# Altium schematic sheet RF_Antenna.SchDoc: Antenna & Radio Interface
size A4; Author: SORABH GANDHI; DrawnBy: SORABH GANDHI; Engineer: SORABH GANDHI; Organization: University Of Colorado Boulder; Revision: 1.0; SheetNumber: 5; SheetTotal: 10; ProjectName: Low Power Project
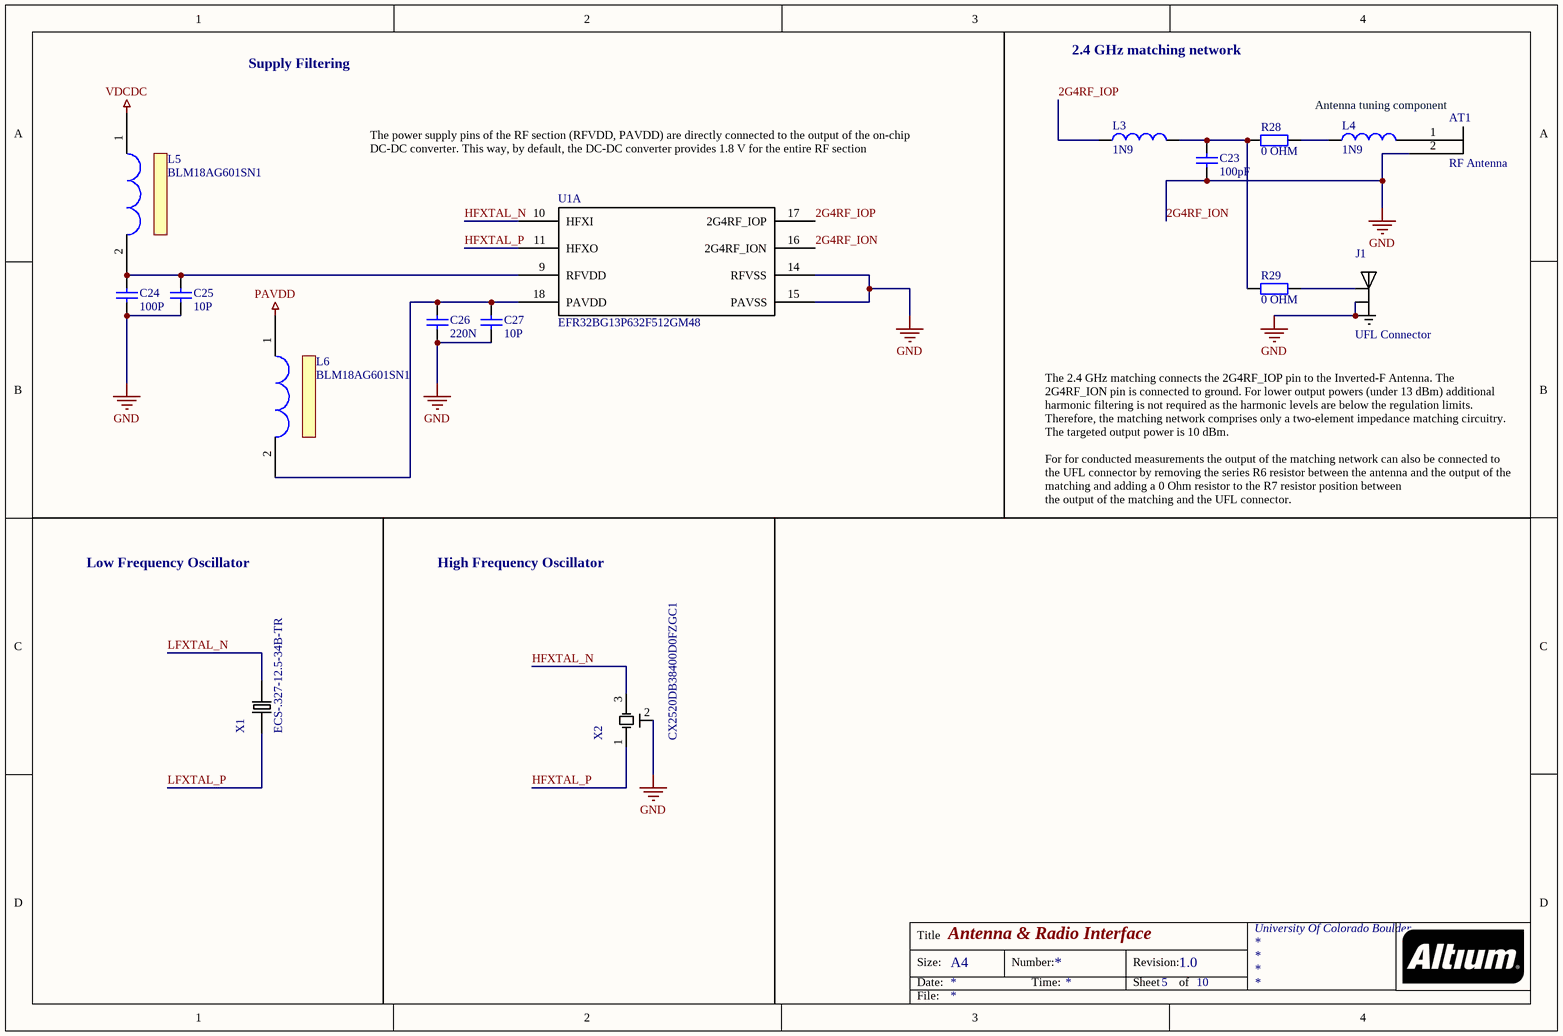
[diagram p0: RF_Antenna.SchDoc]

## Parts
AT1  RF Antenna  [PCBComponent_1]
C23  100pF  [C1206]
C24  100P  [1608[0603]]
C25  10P  [1608[0603]]
C26  220N  [1608[0603]]
C27  10P  [1608[0603]]
J1  UFL Connector  [*HRS_U.FL-R-SMT-1(10)]
L3  1N9  [0402-A]
L4  1N9  [0402-A]
L5  BLM18AG601SN1  [*CAPC0603X56N]
L6  BLM18AG601SN1  [*CAPC0603X56N]
R28  0 OHM  [1608[0603]]
R29  0 OHM  [1608[0603]]
U1  EFR32BG13P632F512GM48  [*QFN50P700X700X90-49N]  (part A of 3)
X1  ECS-.327-12.5-34B-TR  [*XTAL_ECS-.327-12.5-34B-TR]
X2  CX2520DB38400D0FZGC1  [*OSCCC250X200X55N]

## Nets
2G4RF_ION: AT1.2 C23.1 C24.1 C25.1 C26.1 C27.1 J1.1(GND) J1.3(GND) U1.14(RFVSS) U1.15(PAVSS) U1.16(2G4RF_ION) X2.2(GND)  [also labelled GND]
PAVDD: L6.1
VDCDC: L5.1
2G4RF_IOP: L3.1 U1.17(2G4RF_IOP)
HFXTAL_N: U1.10(HFXI) X2.3
HFXTAL_P: U1.11(HFXO) X2.1
LFXTAL_N: X1.2
LFXTAL_P: X1.1
NetAT1_1: AT1.1 L4.2
NetC23_2: C23.2 L3.2 R28.1 R29.1
NetC24_2: C24.2 C25.2 L5.2 U1.9(RFVDD)
NetC26_2: C26.2 C27.2 L6.2 U1.18(PAVDD)
NetJ1_2: J1.2(SIG) R29.2
NetL4_1: L4.1 R28.2

## Notes on the sheet
- Supply Filtering
- 2.4 GHz matching network
- Antenna tuning component
- The power supply pins of the RF section (RFVDD, PAVDD) are directly connected to the output of the on-chip DC-DC converter. This way, by default, the DC-DC converter provides 1.8 V for the entire RF section
- The 2.4 GHz matching connects the 2G4RF_IOP pin to the Inverted-F Antenna. The 2G4RF_ION pin is connected to ground. For lower output powers (under 13 dBm) additional harmonic filtering is not required as the harmonic levels are below the regulation limits. Therefore, the matching network comprises only a two-element impedance matching circuitry. The targeted output power is 10 dBm.
  For for conducted measurements the output of the matching network can also be connected to the UFL connector by removing the series R6 resistor between the antenna and the output of the matching and adding a 0 Ohm resistor to the R7 resistor position between
  the output of the matching and the UFL connector.
- Low Frequency Oscillator
- High Frequency Oscillator
- Title
- Size:
- Date:
- A4
- Number:
- Time:
- Revision:
- Sheet
- of
- File:

## Library data of the parts
C23 = Cap Semi: CAP CER 1.5PF 50V C0G/NP0 0402; Manufacturer: Murata Electronics; Manufacturer Part Number: GJM1555C1H1R5WB01D; Value: 100pF; Mouser Part Number: 81-GJM1555C1H1R5WB1D; MouserURL: https://www.mouser.com/ProductDetail/Murata-Electronics/GJM1555C1H1R5WB01D?qs=YLLXL5qGyDucsRPozQcunA%3D%3D
C24 = Cap: CAP CER 100PF 16V X7R 0603; Manufacturer: AVX Corporation; Manufacturer Part Number: 0603YC101KAT2A; Value: 100P; DigiKeyURL: https://www.digikey.com/product-detail/en/avx-corporation/0603YC101KAT2A/478-6207-1-ND/2391406; DigiKey Part Number: 478-6207-1-ND
C25 C27 = Cap: CAP CER 10PF 50V C0G/NPO 0603; Manufacturer: Yageo; Manufacturer Part Number: CC0603JRNPO9BN100; Value: 10P; Digi-Key Part Number: 311-1058-1-ND; DigiKeyURL: https://www.digikey.com/product-detail/en/yageo/CC0603JRNPO9BN100/311-1058-1-ND/302968
C26 = Cap: Capacitor; Manufacturer: Taiyo Yuden; Manufacturer Part Number: EMK107B7224KA-T; Value: 220N; Digi-Key Part Number: 587-1249-1-ND; DigiKeyURL: https://www.digikey.com/product-detail/en/taiyo-yuden/EMK107B7224KA-T/587-1249-1-ND/931026
J1 = U.FL-R-SMT-1(10): U.FL Series 6 Ghz 50 Ohm Ultra-small SMT Coaxial Cable Receptacle; Manufacturer: Hirose Connector; Mouser Part Number: 798-U.FL-R-SMT-110; Manufacturer Part Number: U.FL-R-SMT-1(10); MouserURL: https://www.mouser.com/ProductDetail/Hirose-Connector/UFL-R-SMT-110?qs=kL1ClTr6oBoOdtqlGQpQrQ%3D%3D
L3 L4 = Inductor: FIXED IND 1.9NH 220MA 300 MOHM; Manufacturer: Murata Electronics; Manufacturer Part Number: LQP15MN1N9W02D; Value: 1N9; MouserURL: https://www.mouser.com/ProductDetail/Murata-Electronics/LQP15MN1N9W02D?qs=gNAzN4OIlxvRECMB25Zmrw%3D%3D; Mouser Part Number: 81-LQP15MN1N9W02D
L5 L6 = EMI Filter: Manufacturer Part Number: BLM18AG601SN1D; Manufacturer: Murata Electronics; Mouser Part Number: 81-BLM11A601S; MouserURL: https://www.mouser.com/ProductDetail/Murata-Electronics/BLM18AG601SN1D?qs=sGAEpiMZZMtdyQheitOmRV9%252B5BLdsWKJfntqGQ3IlAM%3D
R28 R29 = Res2: RES SMD 0 OHM JUMPER 1/10W 0603; Manufacturer: Yageo; Manufacturer Part Number: RC0603JR-070RL; Value: 0 OHM; Digi-Key Part Number: 311-0.0GRCT-ND; DigiKeyURL: https://www.digikey.com/product-detail/en/yageo/RC0603JR-070RL/311-0.0GRCT-ND/729622
U1 = EFR32BG13: MCU; Manufacturer: Silicon Labs; Manufacturer Part Number: EFR32BG13P632F512GM48-BR; CompDescription: Data Sheet; Value: EFR32BG13P632F512GM48; CompURL: https://www.silabs.com/documents/public/data-sheets/efr32bg13-datasheet.pdf; Mouser Part Number: 634-EFR32BG13P632-BR; MouserURL: https://www.mouser.com/ProductDetail/Silicon-Labs/EFR32BG13P632F512GM48-BR?qs=5aG0NVq1C4xCQ7DNn6l3Yw%3D%3D
X1 = ECS-.327-12.5-34B-TR: Crystal 0.032768MHz Â±20ppm _Tol_ 12.5pF Flexural 70000Ohm 2-Pin Mini-SMD T/R; Manufacturer: ECS; Mouser Part Number: 520-327-12.5-34B; MouserURL: https://www.mouser.com/ProductDetail/ECS/ECS-327-125-34B-TR?qs=xCP1SmiXvZHPyAjhnmNtEw%3D%3D
X2 = CX2520DB38400D0FZGC1: Crystal 38.4MHz 8pF 4-Pin SMD T/R; Manufacturer: Kyocera Electronic Components; Mouser Part Number: 581-CX2520DB3D0FZGC1; Manufacturer Part Number: CX2520DB38400D0FZGC1; MouserURL: https://www.mouser.com/ProductDetail/Kyocera-Electronic-Components/CX2520DB38400D0FZGC1?qs=BybUIy1AcUarvw5E5YY0vQ%3D%3D